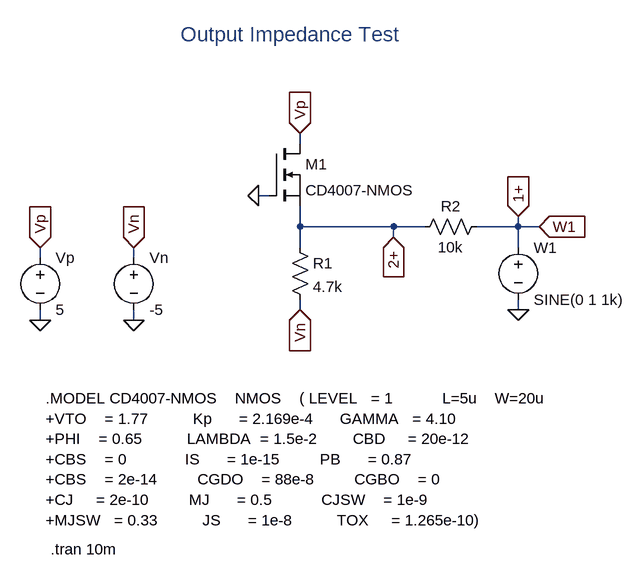
[diagram p0: schematic mos_out_imp_test_ltspice.asc]
mos_out_imp_test_ltspice.asc, the LTspice schematic file:
Version 4
SHEET 1 880 752
WIRE 144 112 144 96
WIRE 96 192 80 192
WIRE 144 240 144 208
WIRE 288 240 144 240
WIRE 336 240 288 240
WIRE 480 240 480 224
WIRE 480 240 416 240
WIRE 512 240 480 240
WIRE 288 256 288 240
WIRE 144 272 144 240
WIRE 480 272 480 240
WIRE -256 288 -256 272
WIRE -112 288 -112 272
WIRE 144 368 144 352
WIRE 480 368 480 352
WIRE -256 384 -256 368
WIRE -112 384 -112 368
FLAG 80 192 0
FLAG 512 240 W1
IOPIN 512 240 In
FLAG 480 224 1+
IOPIN 480 224 In
FLAG 144 96 Vp
IOPIN 144 96 In
FLAG 144 368 Vn
IOPIN 144 368 In
FLAG 288 256 2+
IOPIN 288 256 In
FLAG 480 368 0
FLAG -256 384 0
FLAG -112 384 0
FLAG -256 272 Vp
IOPIN -256 272 In
FLAG -112 272 Vn
IOPIN -112 272 In
SYMBOL nmos 96 112 R0
SYMATTR InstName M1
SYMATTR Value CD4007-NMOS
SYMBOL res 128 256 R0
SYMATTR InstName R1
SYMATTR Value 4.7k
SYMBOL res 432 224 R90
WINDOW 0 0 56 VBottom 2
WINDOW 3 32 56 VTop 2
SYMATTR InstName R2
SYMATTR Value 10k
SYMBOL voltage 480 256 R0
WINDOW 123 0 0 Left 0
WINDOW 39 0 0 Left 0
SYMATTR InstName W1
SYMATTR Value SINE(0 1 1k)
SYMBOL voltage -112 272 R0
WINDOW 123 0 0 Left 0
WINDOW 39 0 0 Left 0
SYMATTR InstName Vn
SYMATTR Value -5
SYMBOL voltage -256 272 R0
WINDOW 123 0 0 Left 0
WINDOW 39 0 0 Left 0
SYMATTR InstName Vp
SYMATTR Value 5
TEXT -40 -56 Left 3 ;Output Impedance Test
TEXT -248 504 Left 2 !.MODEL CD4007-NMOS    NMOS    ( LEVEL   = 1           L=5u    W=20u             \n+VTO    = 1.77          Kp      = 2.169e-4      GAMMA   = 4.10  \n+PHI    = 0.65          LAMBDA  = 1.5e-2        CBD     = 20e-12\n+CBS    = 0             IS      = 1e-15         PB      = 0.87\n+CBS    = 2e-14         CGDO    = 88e-8         CGBO    = 0\n+CJ     = 2e-10         MJ      = 0.5           CJSW    = 1e-9\n+MJSW   = 0.33          JS      = 1e-8          TOX     = 1.265e-10)
TEXT -240 736 Left 2 !.tran 10m

The netlist it stands for:
* mos_out_imp_test_ltspice.asc
M1 Vp 0 2+ 2+ CD4007-NMOS
R1 2+ Vn 4.7k
R2 1+ 2+ 10k
V§W1 1+ 0 SINE(0 1 1k)
Vn Vn 0 -5
Vp Vp 0 5
.model NMOS NMOS
.model PMOS PMOS
.lib standard.mos
* Output Impedance Test
.MODEL CD4007-NMOS    NMOS    ( LEVEL   = 1           L=5u    W=20u
+VTO    = 1.77          Kp      = 2.169e-4      GAMMA   = 4.10
+PHI    = 0.65          LAMBDA  = 1.5e-2        CBD     = 20e-12
+CBS    = 0             IS      = 1e-15         PB      = 0.87
+CBS    = 2e-14         CGDO    = 88e-8         CGBO    = 0
+CJ     = 2e-10         MJ      = 0.5           CJSW    = 1e-9
+MJSW   = 0.33          JS      = 1e-8          TOX     = 1.265e-10)
.tran 10m
.backanno
.end